# Altium schematic sheet reference.SchDoc
size A3; SheetNumber: 3; SheetTotal: 3
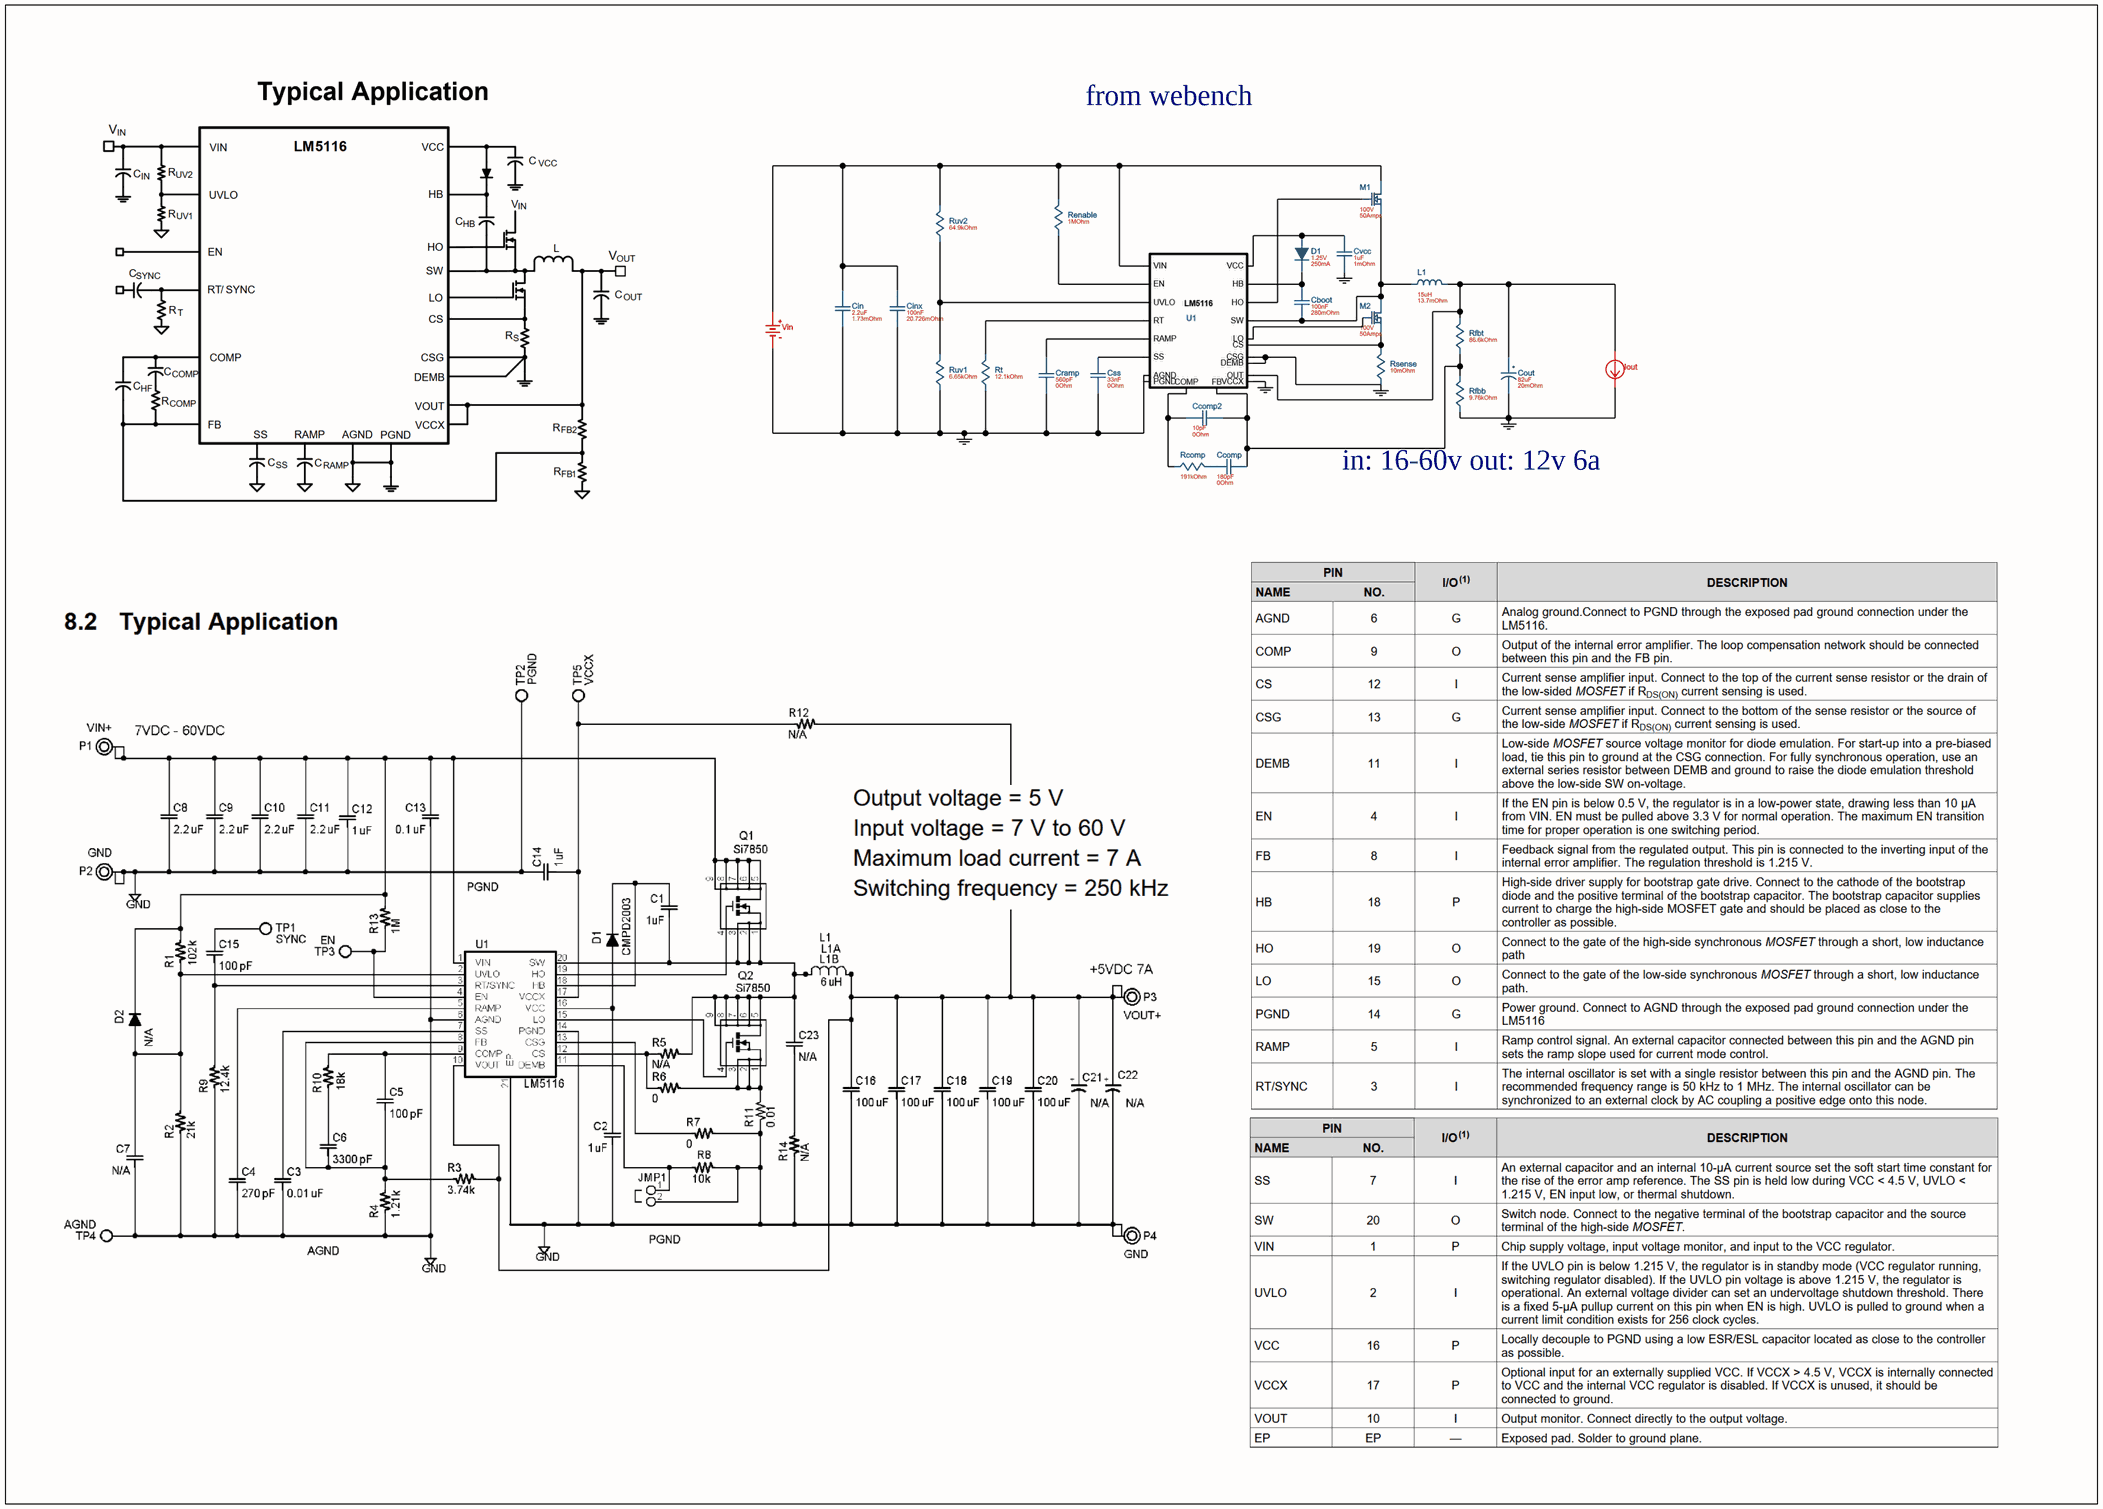
[diagram p0: reference.SchDoc]

## Notes on the sheet
- from webench
- in: 16-60v out: 12v 6a